# EAGLE schematic Schematic (EAGLE 9.7.0)
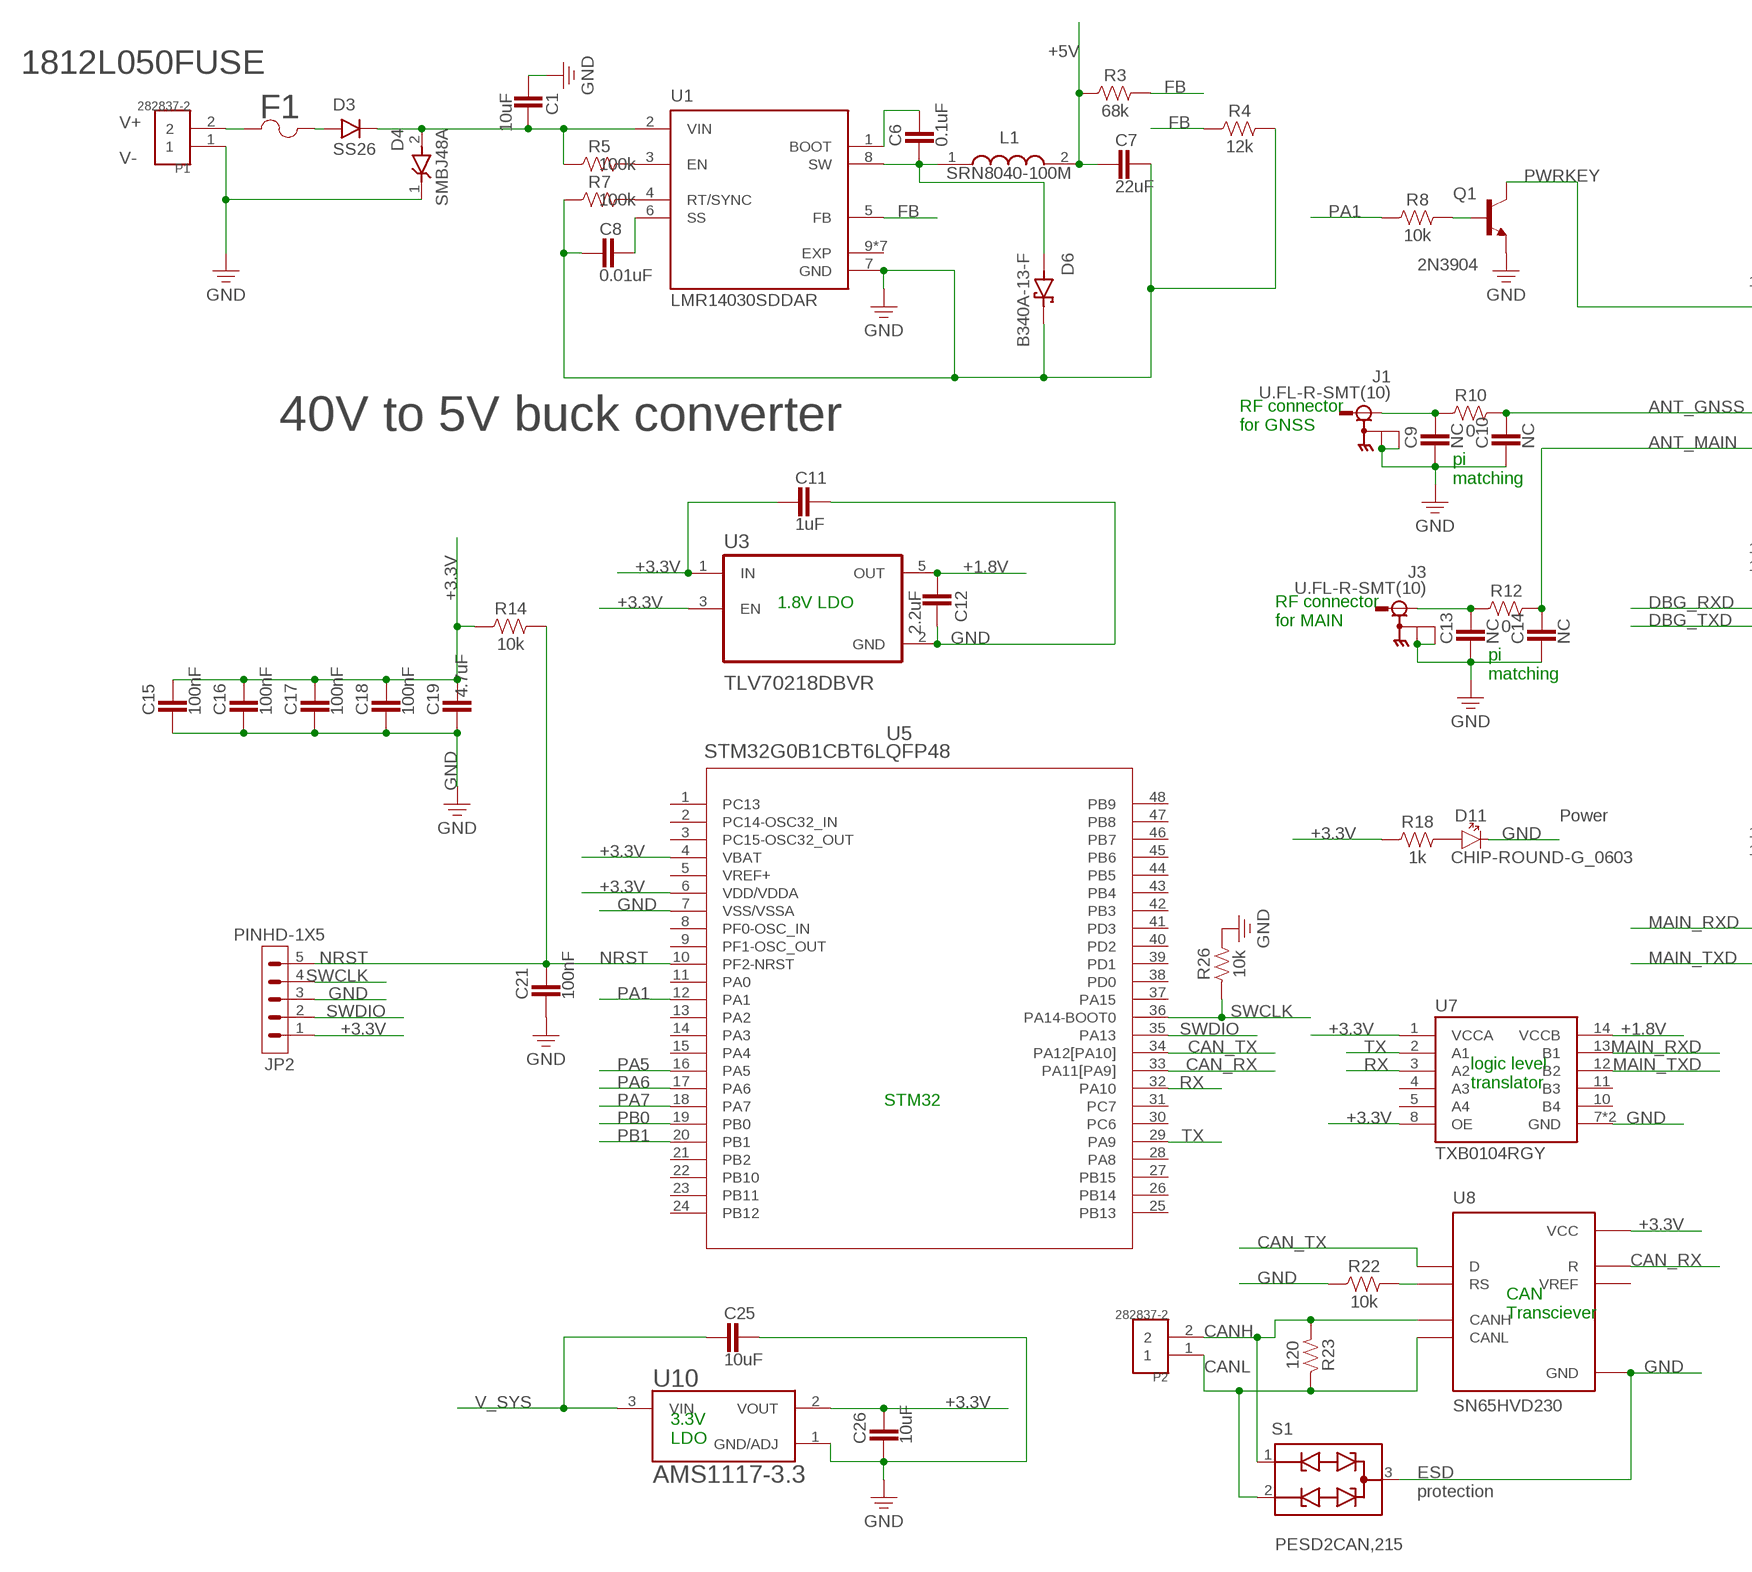
[diagram p0: schematic, sheet 1, part 1 of 2]
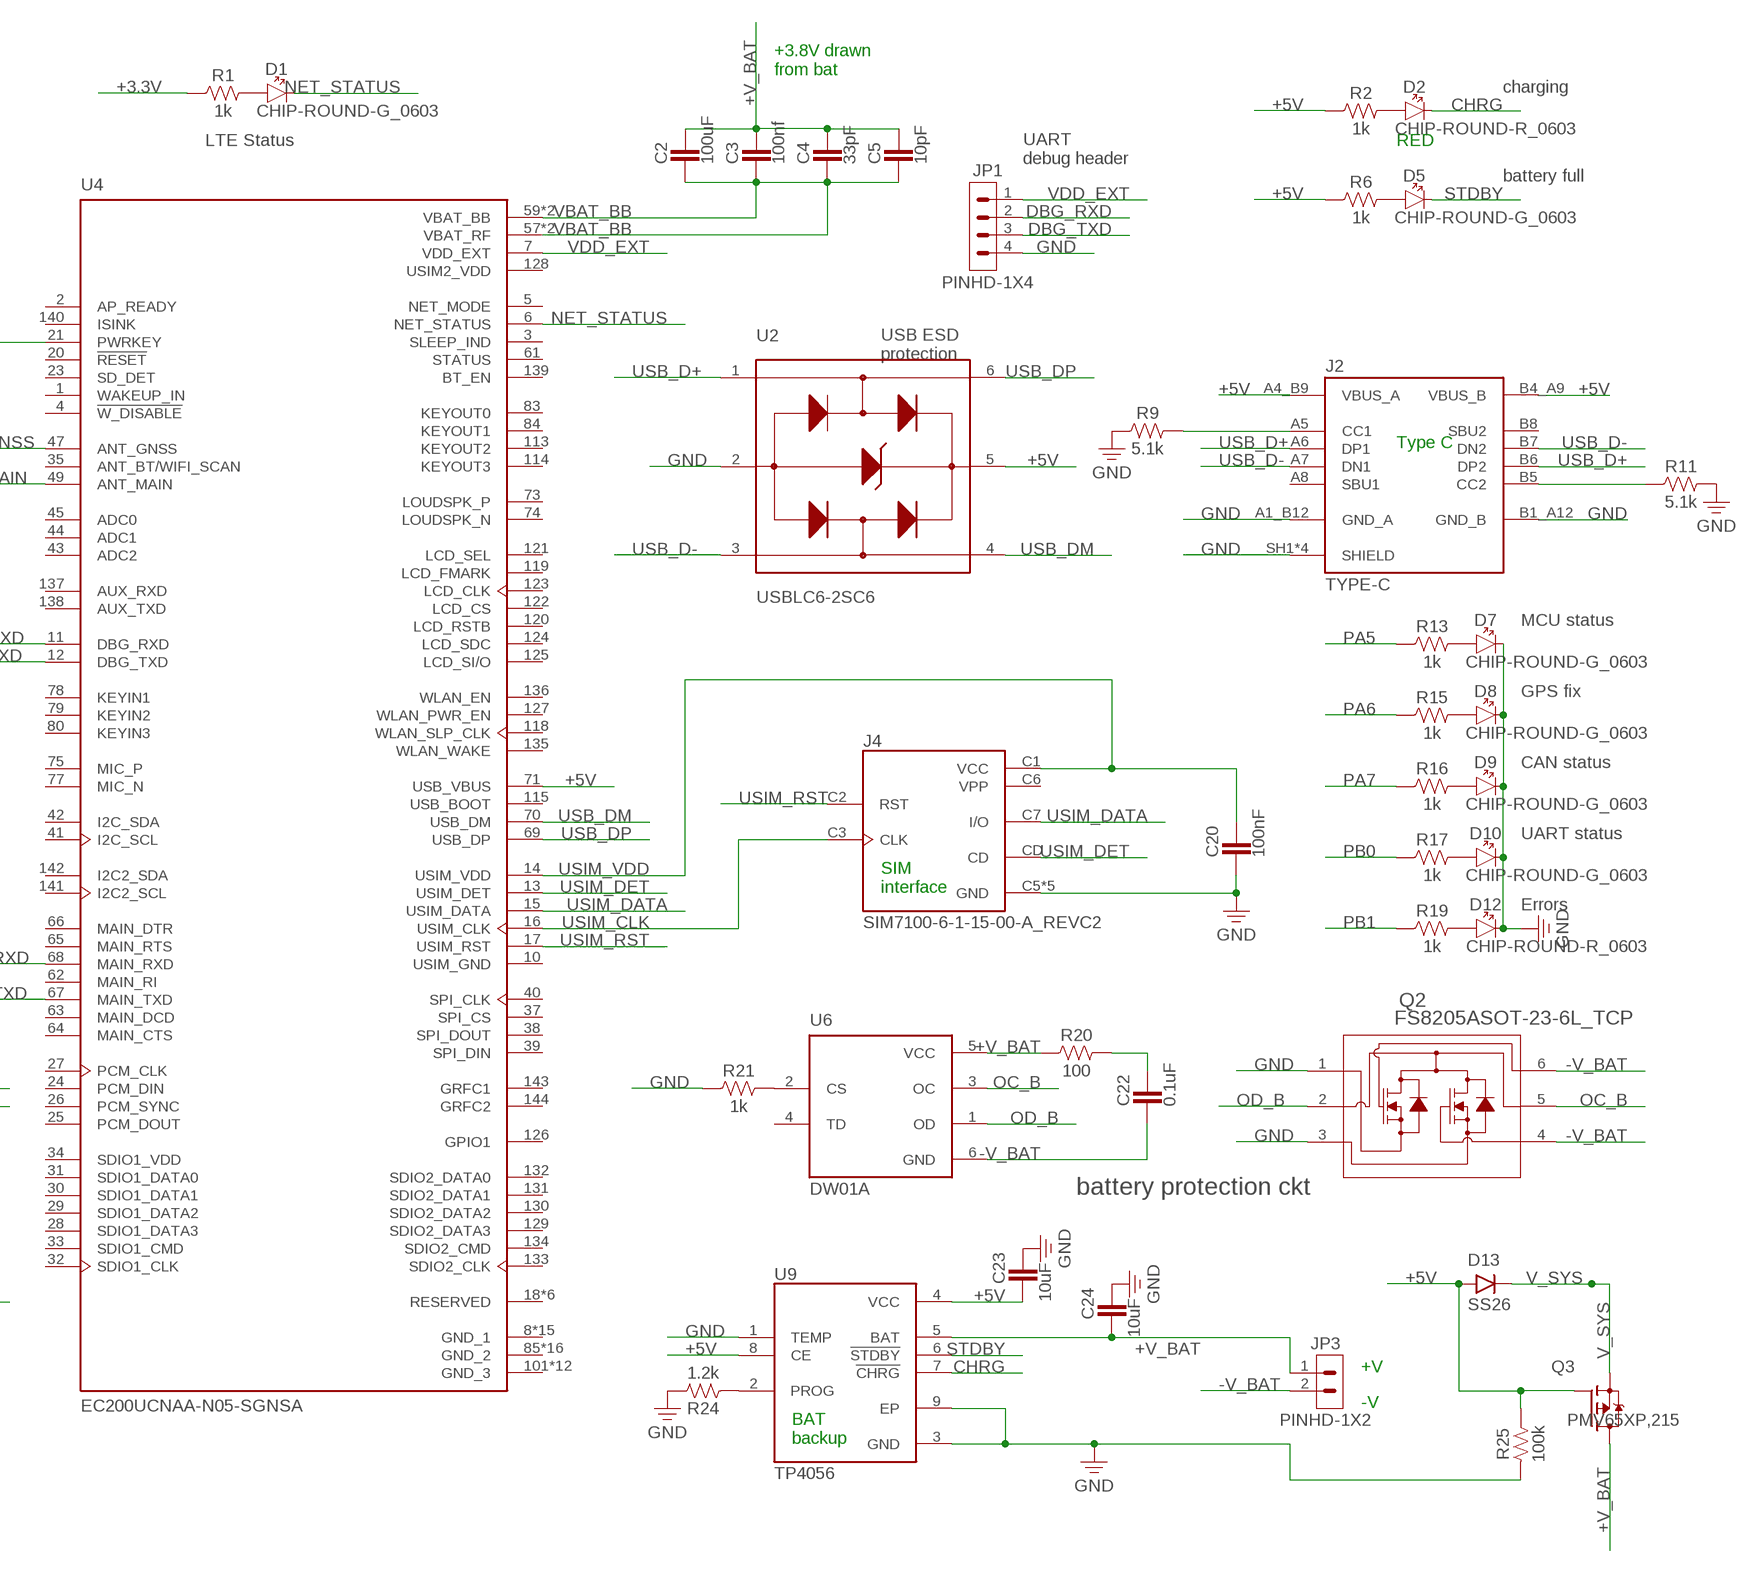
[diagram p1: schematic, sheet 1, part 2 of 2]

## Parts
C1  10uF  CAPACITOR_CHIP-0402(1005-METRIC)  [CAPC1005X60]
C2  100uF  CAPACITOR_CHIP-0603(1608-METRIC)  [CAPC1608X85]
C3  100nf  CAPACITOR_CHIP-0603(1608-METRIC)  [CAPC1608X85]
C4  33pF  CAPACITOR_CHIP-0603(1608-METRIC)  [CAPC1608X85]
C5  10pF  CAPACITOR_CHIP-0603(1608-METRIC)  [CAPC1608X85]
C6  0.1uF  CAPACITOR_CHIP-0402(1005-METRIC)  [CAPC1005X60]
C7  22uF  CAPACITOR_CHIP-0402(1005-METRIC)  [CAPC1005X60]
C8  0.01uF  CAPACITOR_CHIP-0402(1005-METRIC)  [CAPC1005X60]
C9  NC  CAPACITOR_CHIP-0402(1005-METRIC)  [CAPC1005X60]
C10  NC  CAPACITOR_CHIP-0402(1005-METRIC)  [CAPC1005X60]
C11  1uF  CAPACITOR_CHIP-0402(1005-METRIC)  [CAPC1005X60]
C12  2.2uF  CAPACITOR_CHIP-0402(1005-METRIC)  [CAPC1005X60]
C13  NC  CAPACITOR_CHIP-0402(1005-METRIC)  [CAPC1005X60]
C14  NC  CAPACITOR_CHIP-0402(1005-METRIC)  [CAPC1005X60]
C15  100nF  CAPACITOR_CHIP-0402(1005-METRIC)  [CAPC1005X60]
C16  100nF  CAPACITOR_CHIP-0402(1005-METRIC)  [CAPC1005X60]
C17  100nF  CAPACITOR_CHIP-0402(1005-METRIC)  [CAPC1005X60]
C18  100nF  CAPACITOR_CHIP-0402(1005-METRIC)  [CAPC1005X60]
C19  4.7uF  CAPACITOR_CHIP-0402(1005-METRIC)  [CAPC1005X60]
C20  100nF  CAPACITOR_CHIP-0402(1005-METRIC)  [CAPC1005X60]
C21  100nF  CAPACITOR_CHIP-0402(1005-METRIC)  [CAPC1005X60]
C22  0.1uF  CAPACITOR_CHIP-0402(1005-METRIC)  [CAPC1005X60]
C23  10uF  CAPACITOR_CHIP-0402(1005-METRIC)  [CAPC1005X60]
C24  10uF  CAPACITOR_CHIP-0402(1005-METRIC)  [CAPC1005X60]
C25  10uF  CAPACITOR_CHIP-0402(1005-METRIC)  [CAPC1005X60]
C26  10uF  CAPACITOR_CHIP-0402(1005-METRIC)  [CAPC1005X60]
D1  CHIP-ROUND-G_0603  [LEDC1608X65N_RND-G]
D2  CHIP-ROUND-R_0603  [LEDC1608X65N_RND-R]
D3  SS26  [SS26]
D4  SMBJ48A  [DIOM5436X261N]
D5  CHIP-ROUND-G_0603  [LEDC1608X65N_RND-G]
D6  B340A-13-F  [DIOM5226X240N]
D7  CHIP-ROUND-G_0603  [LEDC1608X65N_RND-G]
D8  CHIP-ROUND-G_0603  [LEDC1608X65N_RND-G]
D9  CHIP-ROUND-G_0603  [LEDC1608X65N_RND-G]
D10  CHIP-ROUND-G_0603  [LEDC1608X65N_RND-G]
D11  CHIP-ROUND-G_0603  [LEDC1608X65N_RND-G]
D12  CHIP-ROUND-R_0603  [LEDC1608X65N_RND-R]
D13  SS26  [SS26]
F1  1812L050FUSE  1812L050/60MRFUSE_1812L05060_LTF  [FUSE_1812L05060_LTF]
J1  U.FL-R-SMT(10)  [HIROSE_U.FL-R-SMT(10)]
J2  TYPE-C  TYPE-C_16PIN_2MD_(073)  [SHOUHAN_TYPE-C_16PIN_2MD_(073)]
J3  U.FL-R-SMT(10)  [HIROSE_U.FL-R-SMT(10)]
J4  SIM7100-6-1-15-00-A_REVC2  [GCT_SIM7100-6-1-15-00-A_REVC2]
JP1  PINHD-1X4  [1X04]
JP2  PINHD-1X5  [1X05]
JP3  PINHD-1X2  [1X02]
L1  SRN8040-100M  [SRN8040100M]
P1  282837-2  [TE_282837-2]
P2  282837-2  [TE_282837-2]
Q1  2N3904  [TO92127P495H495-3]
Q2  FS8205ASOT-23-6L_TCP  [SOT-23-6L_TCP]
Q3  PMV65XP,215  [SOT95P230X110-3N]
R1  1k  R-US_CHIP-0402(1005-METRIC)  [RESC1005X40]
R2  1k  R-US_CHIP-0402(1005-METRIC)  [RESC1005X40]
R3  68k  R-US_CHIP-0402(1005-METRIC)  [RESC1005X40]
R4  12k  R-US_CHIP-0402(1005-METRIC)  [RESC1005X40]
R5  100k  R-US_CHIP-0402(1005-METRIC)  [RESC1005X40]
R6  1k  R-US_CHIP-0402(1005-METRIC)  [RESC1005X40]
R7  100k  R-US_CHIP-0402(1005-METRIC)  [RESC1005X40]
R8  10k  R-US_CHIP-0402(1005-METRIC)  [RESC1005X40]
R9  5.1k  R-US_CHIP-0402(1005-METRIC)  [RESC1005X40]
R10  0  R-US_CHIP-0402(1005-METRIC)  [RESC1005X40]
R11  5.1k  R-US_CHIP-0402(1005-METRIC)  [RESC1005X40]
R12  0  R-US_CHIP-0402(1005-METRIC)  [RESC1005X40]
R13  1k  R-US_CHIP-0402(1005-METRIC)  [RESC1005X40]
R14  10k  R-US_CHIP-0402(1005-METRIC)  [RESC1005X40]
R15  1k  R-US_CHIP-0402(1005-METRIC)  [RESC1005X40]
R16  1k  R-US_CHIP-0402(1005-METRIC)  [RESC1005X40]
R17  1k  R-US_CHIP-0402(1005-METRIC)  [RESC1005X40]
R18  1k  R-US_CHIP-0402(1005-METRIC)  [RESC1005X40]
R19  1k  R-US_CHIP-0402(1005-METRIC)  [RESC1005X40]
R20  100  R-US_CHIP-0402(1005-METRIC)  [RESC1005X40]
R21  1k  R-US_CHIP-0402(1005-METRIC)  [RESC1005X40]
R22  10k  R-US_CHIP-0402(1005-METRIC)  [RESC1005X40]
R23  120  R-US_CHIP-0402(1005-METRIC)  [RESC1005X40]
R24  1.2k  R-US_CHIP-0402(1005-METRIC)  [RESC1005X40]
R25  100k  R-US_CHIP-0402(1005-METRIC)  [RESC1005X40]
R26  10k  R-US_CHIP-0402(1005-METRIC)  [RESC1005X40]
S1  PESD2CAN,215  [DIO_PESD2CAN,215]
U1  LMR14030SDDAR  [SOIC127P600X170-9N]
U2  USBLC6-2SC6  [SOT95P280X145-6N]
U3  TLV70218DBVR  [SOT95P280X145-5N]
U4  EC200UCNAA-N05-SGNSA  [XCVR_EC200UCNAA-N05-SGNSA]
U5  STM32G0B1CBT6LQFP48  STM32G0B1CBT6LQFP48_STM32G0B1CBT_STM  [LQFP48_STM32G0B1CBT_STM]
U6  DW01A  [SOT95P280X145-6N]
U7  TXB0104RGY  [S-PVQFN-N14]
U8  SN65HVD230  [SOIC127P599X175-8N]
U9  TP4056  [SOP127P600X175-9N]
U10  AMS1117-3.3  [SOT229P700X180-4N]

## Nets
+1.8V: C12.2 U3.5(OUT) U7.14(VCCB)
+3.3V: C11.2 C15.1 C16.1 C17.1 C18.1 C19.1 C26.1 JP2.1 R1.1 R14.1 R18.1 U3.1(IN) U3.3(EN) U5.4(VBAT) U5.6(VDD/VDDA) U7.1(VCCA) U7.8(OE) U8.3(VCC) U10.2(VOUT)
+5V: C7.2 C23.2 D13.A J2.A4_B9(VBUS_A) J2.B4_A9(VBUS_B) L1.2 Q3.1(G) R2.1 R3.1 R6.1 R25.2 U2.5(VBUS) U4.71(USB_VBUS) U9.4(VCC) U9.8(CE)
+V_BAT: C2.1 C3.1 C4.1 C5.1 C24.2 JP3.1 Q3.3(D) R20.1 U6.5(VCC) U9.5(BAT)
-V_BAT: C22.2 JP3.2 Q2.4 Q2.6 U6.6(GND)
ANT_GNSS: C10.1 R10.2 U4.47(ANT_GNSS)
ANT_MAIN: C14.1 R12.2 U4.49(ANT_MAIN)
CAN_RX: U5.33(PA11[PA9]) U8.4(R)
CAN_TX: U5.34(PA12[PA10]) U8.1(D)
CANH: P2.2 R23.2 S1.1(C1) U8.7(CANH)
CHRG: D2.C U9.7(!CHRG)
DBG_RXD: JP1.2 U4.11(DBG_RXD)
DBG_TXD: JP1.3 U4.12(DBG_TXD)
FB: R3.2 R4.1 U1.5(FB)
GND: C1.2 C7.1 C8.2 C9.2 C10.2 C11.1 C12.1 C13.2 C14.2 C15.2 C16.2 C17.2 C18.2 C19.2 C20.2 C21.2 C23.1 C24.1 C25.1 C26.2 D4.1(K) D6.C D7.C D8.C D9.C D10.C D11.C D12.C J1.G1 J1.G2 J2.A1_B12(GND_A) J2.B1_A12(GND_B) J2.SH1(SHIELD) J2.SH2(SHIELD) J2.SH3(SHIELD) J2.SH4(SHIELD) J3.G1 J3.G2 J4.C5(GND) J4.G1(GND) J4.G2(GND) J4.G3(GND) J4.G4(GND) JP1.4 JP2.3 P1.1 Q1.1(E) Q2.1 Q2.3 R4.2 R7.1 R9.1 R11.2 R21.1 R22.1 R24.2 R25.1 R26.2 S1.3(CC) U1.7(GND) U2.2(GND) U3.2(GND) U5.7(VSS/VSSA) U7.7(GND) U7.THERMALPAD(GND) U8.2(GND) U9.1(TEMP) U9.3(GND) U9.9(EP) U10.1(GND/ADJ)
MAIN_RXD: U4.68(MAIN_RXD) U7.13(B1)
MAIN_TXD: U4.67(MAIN_TXD) U7.12(B2)
N$1: Q1.2(B) R8.2
N$2: J2.A5(CC1) R9.2
N$3: J2.B5(CC2) R11.1
N$4: C9.1 J1.SIG R10.1
N$5: R24.1 U9.2(PROG)
N$6: D2.A R2.2
N$7: D5.A R6.2
N$8: C13.1 J3.SIG R12.1
N$9: R22.2 U8.8(RS)
N$10: F1.1 P1.2
N$11: D3.A F1.2
N$12: C1.1 D3.C D4.2(A) R5.1 U1.2(VIN)
N$13: C6.1 U1.1(BOOT)
N$14: C6.2 D6.A L1.1 U1.8(SW)
N$15: R5.2 U1.3(EN)
N$16: R7.2 U1.4(RT/SYNC)
N$17: C8.1 U1.6(SS)
N$18: R21.2 U6.2(CS)
N$19: D11.A R18.2
N$20: C22.1 R20.2
N$21: P2.1 R23.1 S1.2(C2) U8.6(CANL)
N$22: D1.A R1.2
N$23: D7.A R13.2
N$24: D8.A R15.2
N$25: D9.A R16.2
N$26: D10.A R17.2
N$27: D12.A R19.2
NET_STATUS: D1.C U4.6(NET_STATUS)
NRST: C21.1 JP2.5 R14.2 U5.10(PF2-NRST)
OC_B: Q2.5 U6.3(OC)
OD_B: Q2.2 U6.1(OD)
PA1: R8.1 U5.12(PA1)
PA5: R13.1 U5.16(PA5)
PA6: R15.1 U5.17(PA6)
PA7: R16.1 U5.18(PA7)
PB0: R17.1 U5.19(PB0)
PB1: R19.1 U5.20(PB1)
PWRKEY: Q1.3(C) U4.21(PWRKEY)
RX: U5.32(PA10) U7.3(A2)
STDBY: D5.C U9.6(!STDBY)
SWCLK: JP2.4 R26.1 U5.36(PA14-BOOT0)
SWDIO: JP2.2 U5.35(PA13)
TX: U5.29(PA9) U7.2(A1)
USB_D+: J2.A6(DP1) J2.B6(DP2) U2.1(I/O1_IN)
USB_D-: J2.A7(DN1) J2.B7(DN2) U2.3(I/O2_IN)
USB_DM: U2.4(I/O2_OUT) U4.70(USB_DM)
USB_DP: U2.6(I/O1_OUT) U4.69(USB_DP)
USIM_CLK: J4.C3(CLK) U4.16(USIM_CLK)
USIM_DATA: J4.C7(I/O) U4.15(USIM_DATA)
USIM_DET: J4.CD U4.13(USIM_DET)
USIM_RST: J4.C2(RST) U4.17(USIM_RST)
USIM_VDD: C20.1 J4.C1(VCC) U4.14(USIM_VDD)
V_SYS: C25.2 D13.C Q3.2(S) U10.3(VIN)
VBAT_BB: C2.2 C3.2 C4.2 C5.2 U4.57(VBAT_RF) U4.58(VBAT_RF) U4.59(VBAT_BB) U4.60(VBAT_BB)
VDD_EXT: JP1.1 U4.7(VDD_EXT)
Unconnected: J2.A8(SBU1) J2.B8(SBU2) U4.1(WAKEUP_IN) U4.2(AP_READY) U4.3(SLEEP_IND) U4.4(!W_DISABLE) U4.5(NET_MODE) U4.18(RESERVED) U4.20(!RESET) U4.23(SD_DET) U4.24(PCM_DIN) U4.25(PCM_DOUT) U4.26(PCM_SYNC) U4.27(PCM_CLK) U4.28(SDIO1_DATA3) U4.29(SDIO1_DATA2) U4.30(SDIO1_DATA1) U4.31(SDIO1_DATA0) U4.32(SDIO1_CLK) U4.33(SDIO1_CMD) U4.35(ANT_BT/WIFI_SCAN) U4.37(SPI_CS) U4.38(SPI_DOUT) U4.39(SPI_DIN) U4.40(SPI_CLK) U4.41(I2C_SCL) U4.42(I2C_SDA) U4.43(ADC2) U4.44(ADC1) U4.45(ADC0) U4.55(RESERVED) U4.61(STATUS) U4.62(MAIN_RI) U4.63(MAIN_DCD) U4.64(MAIN_CTS) U4.65(MAIN_RTS) U4.66(MAIN_DTR) U4.73(LOUDSPK_P) U4.74(LOUDSPK_N) U4.75(MIC_P) U4.77(MIC_N) U4.78(KEYIN1) U4.79(KEYIN2) U4.80(KEYIN3) U4.81(RESERVED) U4.82(RESERVED) U4.83(KEYOUT0) U4.84(KEYOUT1) U4.113(KEYOUT2) U4.114(KEYOUT3) U4.115(USB_BOOT) U4.116(RESERVED) U4.117(RESERVED) U4.118(WLAN_SLP_CLK) U4.119(LCD_FMARK) U4.120(LCD_RSTB) U4.121(LCD_SEL) U4.122(LCD_CS) U4.123(LCD_CLK) U4.124(LCD_SDC) U4.125(LCD_SI/O) U4.126(GPIO1) U4.127(WLAN_PWR_EN) U4.129(SDIO2_DATA3) U4.130(SDIO2_DATA2) U4.131(SDIO2_DATA1) U4.132(SDIO2_DATA0) U4.133(SDIO2_CLK) U4.134(SDIO2_CMD) U4.135(WLAN_WAKE) U4.136(WLAN_EN) U4.137(AUX_RXD) U4.138(AUX_TXD) U4.139(BT_EN) U4.140(ISINK) U4.141(I2C2_SCL) U4.142(I2C2_SDA) U4.143(GRFC1) U4.144(GRFC2) U5.1(PC13) U5.2(PC14-OSC32_IN) U5.3(PC15-OSC32_OUT) U5.8(PF0-OSC_IN) U5.9(PF1-OSC_OUT) U5.11(PA0) U5.13(PA2) U5.14(PA3) U5.15(PA4) U5.21(PB2) U5.22(PB10) U5.23(PB11) U5.24(PB12) U5.25(PB13) U5.26(PB14) U5.27(PB15) U5.28(PA8) U5.30(PC6) U5.31(PC7) U5.37(PA15) U5.38(PD0) U5.39(PD1) U5.40(PD2) U5.41(PD3) U5.42(PB3) U5.43(PB4) U5.44(PB5) U5.45(PB6) U5.46(PB7) U5.47(PB8) U5.48(PB9) U6.4(TD) U7.4(A3) U7.5(A4) U7.10(B4) U7.11(B3) U8.5(VREF)

## Notes on the sheet
- +3.8V drawn
  from bat
- charging
- LTE Status | RED
- V+
- UART 
  debug header
- battery full
- V-
- USB ESD
  protection
- Type C
- 40V to 5V buck converter
- RF connector 
  for GNSS
- pi 
  matching
- MCU status
- 1.8V LDO
- RF connector 
  for MAIN
- GPS fix
- pi 
  matching
- CAN status
- UART status
- Power
- SIM
  interface
- Errors
- logic level
  translator
- STM32
- battery protection ckt
- CANH
- CAN
  Transciever
- +V
- CANL | -V
- BAT
  backup
- 3.3V
  LDO
- ESD
  protection

## Power pins joined to a net without a drawn wire
EXP: U1.9(EXP) U1.V1(EXP) U1.V2(EXP) U1.V3(EXP) U1.V4(EXP) U1.V5(EXP) U1.V6(EXP)
GND_1: U4.8(GND_1) U4.9(GND_1) U4.19(GND_1) U4.22(GND_1) U4.36(GND_1) U4.46(GND_1) U4.48(GND_1) U4.50(GND_1) U4.51(GND_1) U4.52(GND_1) U4.53(GND_1) U4.54(GND_1) U4.56(GND_1) U4.72(GND_1) U4.76(GND_1)
GND_2: U4.85(GND_2) U4.86(GND_2) U4.87(GND_2) U4.88(GND_2) U4.89(GND_2) U4.90(GND_2) U4.91(GND_2) U4.92(GND_2) U4.93(GND_2) U4.94(GND_2) U4.95(GND_2) U4.96(GND_2) U4.97(GND_2) U4.98(GND_2) U4.99(GND_2) U4.100(GND_2)
GND_3: U4.101(GND_3) U4.102(GND_3) U4.103(GND_3) U4.104(GND_3) U4.105(GND_3) U4.106(GND_3) U4.107(GND_3) U4.108(GND_3) U4.109(GND_3) U4.110(GND_3) U4.111(GND_3) U4.112(GND_3)
SDIO1_VDD: U4.34(SDIO1_VDD)
USIM2_VDD: U4.128(USIM2_VDD)
USIM_GND: U4.10(USIM_GND)
VPP: J4.C6(VPP)
VREF+: U5.5(VREF+)

## Library data of the parts
C1-C26 = Tinkercad:CAPACITOR: Capacitor - Generic; CATEGORY: Capacitor
D1 D5 D7-D11 = LED:CHIP-ROUND-G: Green LED - Generic; CATEGORY: LED; COLOR: Green; DESCRIPTION: Green LED Indication 0603 (1608 Metric); PACKAGE_SIZE: 0603; PACKAGE_TYPE: Surface Mount; SUBCATEGORY: Chip LED; TYPE: Square with Domed Top
D2 D12 = LED:CHIP-ROUND-R: Red LED - Generic; CATEGORY: LED; COLOR: Red; DESCRIPTION: Red LED Indication 0603 (1608 Metric); PACKAGE_SIZE: 0603; PACKAGE_TYPE: Surface Mount; SUBCATEGORY: Chip LED; TYPE: Square with Domed Top
D3 D13 = SS26:SS26: Check availability <https://pricing.snapeda.com/parts/SS26/ON%20Semiconductor/view-part?ref=eda>; AVAILABILITY: In Stock; CHECK_PRICES: https://www.snapeda.com/parts/SS26/Onsemi/view-part/?ref=eda; DESCRIPTION: Schottkydiod 2 A 60 V DO-214AA%3DSMB | Vishay SS26 @ Schottkydioder (Schottkydiod 2 A 60 V DO-214AA%3DSMB Dioder / Småsignals Schottky-dioder); MF: ON Semiconductor; MP: SS26; PACKAGE: SMB-2 ON Semiconductor; PRICE: None; SNAPEDA_LINK: https://www.snapeda.com/parts/SS26/Onsemi/view-part/?ref=snap
D4 = SMBJ48A:SMBJ48A: Check availability <https://pricing.snapeda.com/parts/SMBJ48A/Littelfuse/view-part?ref=eda>; AVAILABILITY: In Stock; CHECK_PRICES: https://www.snapeda.com/parts/SMBJ48A/Littelfuse/view-part/?ref=eda; DESCRIPTION: TVS Diode, 600W, 48V, -65 to 150 Operating Temp, Surface Mount, SMBJ Series | Littelfuse SMBJ48A; MF: Littelfuse; MP: SMBJ48A; PACKAGE: DO-214 Littelfuse; PRICE: None; SNAPEDA_LINK: https://www.snapeda.com/parts/SMBJ48A/Littelfuse/view-part/?ref=snap
D6 = B340A-13-F:B340A-13-F: Check availability <https://pricing.snapeda.com/parts/B340A-13-F/Diodes%20Inc./view-part?ref=eda>; AVAILABILITY: In Stock; CHECK_PRICES: https://www.snapeda.com/parts/B340A-13-F/Diodes+Inc./view-part/?ref=eda; DESCRIPTION: Schottky Diode 3A 40V 0.5Vf SMA | Diodes Inc B340A-13-F; MF: Diodes Inc.; MP: B340A-13-F; PACKAGE: DO-214 Diodes Inc.; PRICE: None; SNAPEDA_LINK: https://www.snapeda.com/parts/B340A-13-F/Diodes+Inc./view-part/?ref=snap
F1 = 1812L05060MR:1812L050/60MR; COPYRIGHT: Copyright (C) 2026 Ultra Librarian. All rights reserved.; MANUFACTURER_NAME: Littelfuse Inc; MANUFACTURER_PART_NUMBER: 1812L050/60MR
J1 J3 = U.FL-R-SMT_10_:U.FL-R-SMT(10): Check availability <https://pricing.snapeda.com/parts/U.FL-R-SMT%2810%29/Hirose%20Electric%20Co%20Ltd/view-part?ref=eda>; AVAILABILITY: In Stock; CHECK_PRICES: https://www.snapeda.com/parts/U.FL-R-SMT(10)/Hirose+Electric+Co+Ltd/view-part/?ref=eda; DESCRIPTION: U.FL (UMCC) Connector Receptacle, Male Pin 50 Ohms Surface Mount Solder; MF: Hirose Electric Co Ltd; MP: U.FL-R-SMT(10); PACKAGE: None; PRICE: None; SNAPEDA_LINK: https://www.snapeda.com/parts/U.FL-R-SMT(10)/Hirose+Electric+Co+Ltd/view-part/?ref=snap
J2 = TYPE-C_16PIN_2MD__073_:TYPE-C_16PIN_2MD_(073): Check availability <https://pricing.snapeda.com/parts/TYPE-C%2016PIN%202MD%20%28073%29/Shouhan/view-part?ref=eda>; AVAILABILITY: Not in stock; CHECK_PRICES: https://www.snapeda.com/parts/TYPE-C%2016PIN%202MD%20(073)/Shouhan/view-part/?ref=eda; DESCRIPTION: DC-5V 5A Type C USB; MF: Shouhan; MP: TYPE-C 16PIN 2MD (073); PACKAGE: Package; PRICE: None; SNAPEDA_LINK: https://www.snapeda.com/parts/TYPE-C%2016PIN%202MD%20(073)/Shouhan/view-part/?ref=snap
J4 = SIM7100-6-1-15-00-A_REVC2:SIM7100-6-1-15-00-A_REVC2: Check availability <https://pricing.snapeda.com/parts/SIM7100-6-1-15-00-A/Global%20Connector%20Technology/view-part?ref=eda>; AVAILABILITY: In Stock; CHECK_PRICES: https://www.snapeda.com/parts/SIM7100-6-1-15-00-A/Global+Connector+Technology/view-part/?ref=eda; DESCRIPTION: 7 (6 + 1) Position Card Connector Micro SIM Surface Mount, Right Angle Gold; MF: Global Connector Technology; MP: SIM7100-6-1-15-00-A; PACKAGE: None; PRICE: None; SNAPEDA_LINK: https://www.snapeda.com/parts/SIM7100-6-1-15-00-A/Global+Connector+Technology/view-part/?ref=snap
JP1 = Connector:PINHD-1X4: Pin Header; CATEGORY: Connectors; DESCRIPTION: Header-Straight-4 Position; PACKAGE_TYPE: Through Hole; PITCH: 0.100" (2.54mm); SUBCATEGORY: Headers; TYPE: Male Pins
JP2 = Connector:PINHD-1X5: Pin Header; CATEGORY: Connectors; DESCRIPTION: Header-Straight-5 Position; PACKAGE_TYPE: Through Hole; PITCH: 0.100" (2.54mm); SUBCATEGORY: Headers; TYPE: Male Pins
JP3 = Connector:PINHD-1X2: Pin Header; CATEGORY: Connectors; DESCRIPTION: Header-Straight-2 Position; PACKAGE_TYPE: Through Hole; PITCH: 0.100" (2.54mm); SUBCATEGORY: Headers; TYPE: Male Pins
L1 = SRN8040-100M:SRN8040-100M: Bourns SRN8040 Series Type SMD Shielded Wire-wound SMD Inductor with a Ferrite Core, 10 uH +/-20% Semi-Shielded 3.1A Idc Source: Datasheet <https://componentsearchengine.com/Datasheets/1/SRN8040-100M.pdf>; ARROW_PART_NUMBER: SRN8040-100M; ARROW_PRICE-STOCK: https://www.arrow.com/en/products/srn8040-100m/bourns?region=nac; DESCRIPTION: Bourns SRN8040 Series Type SMD Shielded Wire-wound SMD Inductor with a Ferrite Core, 10 uH +/-20% Semi-Shielded 3.1A Idc; HEIGHT: 4mm; MANUFACTURER_NAME: Bourns; MANUFACTURER_PART_NUMBER: SRN8040-100M; MOUSER_PART_NUMBER: 652-SRN8040-100M; MOUSER_PRICE-STOCK: https://www.mouser.co.uk/ProductDetail/Bourns/SRN8040-100M?qs=opBjA1TV901MvrktVUEKyA%3D%3D
P1 P2 = 282837-2:282837-2: Check availability <https://pricing.snapeda.com/parts/282837-2/TE%20Connectivity/view-part?ref=eda>; AVAILABILITY: In Stock; CHECK_PRICES: https://www.snapeda.com/parts/282837-2/TE+Connectivity+AMP+Connectors/view-part/?ref=eda; COMMENT: 282837-2; DESCRIPTION: Terminal Block Connector Wire Receptacle 2 5.08 mm 30-16 AWG Green 13.5 A 250 V | TE Connectivity 282837-2; MF: TE Connectivity; MP: 282837-2; PACKAGE: None; PRICE: None; SNAPEDA_LINK: https://www.snapeda.com/parts/282837-2/TE+Connectivity+AMP+Connectors/view-part/?ref=snap
Q1 = 2N3904:2N3904: Check availability <https://pricing.snapeda.com/parts/2N3904/MICROSS/On%20Semiconductor/view-part?ref=eda>; AVAILABILITY: Not in stock; CHECK_PRICES: https://www.snapeda.com/parts/2N3904/Onsemi/view-part/?ref=eda; DESCRIPTION: Trans GP BJT NPN 40V 0.2A 3-Pin SPT T/R Trans GP BJT NPN 40V 0.2A 3-Pin SPT T/R Trans GP BJT NPN 40V 0.2A 3-Pin SPT T/R; MF: MICROSS/On Semiconductor; MP: 2N3904; PACKAGE: E-PKG AXIAL-LEADED-2 ON Semiconductor; PRICE: None; SNAPEDA_LINK: https://www.snapeda.com/parts/2N3904/Onsemi/view-part/?ref=snap
Q2 = FS8205A:FS8205A; COPYRIGHT: Copyright (C) 2026 Ultra Librarian. All rights reserved.; MANUFACTURER_NAME: Tech Public; MANUFACTURER_PART_NUMBER: FS8205A
Q3 = PMV65XP_215:PMV65XP,215: Check availability <https://pricing.snapeda.com/parts/PMV65XP%2C215/Nexperia/view-part?ref=eda>; AVAILABILITY: In Stock; CHECK_PRICES: https://www.snapeda.com/parts/PMV65XP,215/Nexperia/view-part/?ref=eda; DESCRIPTION: P-Channel 20 V 2.8A (Ta) 480mW (Ta) Surface Mount TO-236AB; MF: Nexperia; MP: PMV65XP,215; PACKAGE: SOT23-3 Nexperia USA Inc.; PRICE: None; SNAPEDA_LINK: https://www.snapeda.com/parts/PMV65XP,215/Nexperia/view-part/?ref=snap
R1-R26 = Resistor:R-US: Resistor Fixed - ANSI; CATEGORY: Resistors; DESCRIPTION: Chip Resistor 1.05 X 0.54 X 0.40 mm body 0402(1005-METRIC) Package; PACKAGE_SIZE: 0402; PACKAGE_TYPE: Surface Mount
S1 = PESD2CAN_215:PESD2CAN,215: Check availability <https://pricing.snapeda.com/parts/PESD2CAN%2C215/Nexperia%20USA/view-part?ref=eda>; AVAILABILITY: In Stock; CHECK_PRICES: https://www.snapeda.com/parts/PESD2CAN,215/Nexperia/view-part/?ref=eda; DESCRIPTION: 41V Clamp 5A (8/20µs) Ipp Tvs Diode Surface Mount TO-236AB; MF: Nexperia USA; MP: PESD2CAN,215; PACKAGE: SOT23-3 Nexperia USA Inc.; PRICE: None; SNAPEDA_LINK: https://www.snapeda.com/parts/PESD2CAN,215/Nexperia/view-part/?ref=snap
U1 = LMR14030SDDAR (1):LMR14030SDDAR: Check availability <https://pricing.snapeda.com/parts/LMR14030SDDAR/Texas%20Instruments/view-part?ref=eda>; AVAILABILITY: In Stock; CHECK_PRICES: https://www.snapeda.com/parts/LMR14030SDDAR/Texas+Instruments/view-part/?ref=eda; DESCRIPTION: SIMPLE SWITCHER® 40-V, 3.5-A, 2.2-MHz step-down converter with 40-uA IQ; MF: Texas Instruments; MP: LMR14030SDDAR; PACKAGE: HSOIC-8 Texas Instruments; PRICE: None; SNAPEDA_LINK: https://www.snapeda.com/parts/LMR14030SDDAR/Texas+Instruments/view-part/?ref=snap
U2 = USBLC6-2SC6:USBLC6-2SC6: Check availability <https://pricing.snapeda.com/parts/USBLC6-2SC6/STMicroelectronics/view-part?ref=eda>; AVAILABILITY: In Stock; CHECK_PRICES: https://www.snapeda.com/parts/USBLC6-2SC6/STMicroelectronics/view-part/?ref=eda; DESCRIPTION: 17V Clamp 5A (8/20µs) Ipp Tvs Diode Surface Mount SOT-23-6; MF: STMicroelectronics; MP: USBLC6-2SC6; PACKAGE: SOT-23-6 STMicroelectronics; PRICE: None; SNAPEDA_LINK: https://www.snapeda.com/parts/USBLC6-2SC6/STMicroelectronics/view-part/?ref=snap
U3 = TLV70218DBVR:TLV70218DBVR: Check availability <https://pricing.snapeda.com/parts/TLV70218DBVR/Texas%20Instruments/view-part?ref=eda>; AVAILABILITY: In Stock; CHECK_PRICES: https://www.snapeda.com/parts/TLV70218DBVR/Texas+Instruments/view-part/?ref=eda; DESCRIPTION: 300-mA, high-PSRR, low-IQ, low-dropout voltage regulator with enable; MF: Texas Instruments; MP: TLV70218DBVR; PACKAGE: SOT-23-5 Texas Instruments; PRICE: None; SNAPEDA_LINK: https://www.snapeda.com/parts/TLV70218DBVR/Texas+Instruments/view-part/?ref=snap
U4 = EC200UCNAA-N05-SGNSA:EC200UCNAA-N05-SGNSA: Check availability <https://pricing.snapeda.com/parts/EC200UCNAA-N05-SGNSA/Quectel/view-part?ref=eda>; AVAILABILITY: In Stock; CHECK_PRICES: https://www.snapeda.com/parts/EC200UCNAA-N05-SGNSA/Quectel/view-part/?ref=eda; DESCRIPTION: Quectel 4G LTE Cat 1 wireless BT GNSS module; MF: Quectel; MP: EC200UCNAA-N05-SGNSA; PACKAGE: None; PRICE: None; SNAPEDA_LINK: https://www.snapeda.com/parts/EC200UCNAA-N05-SGNSA/Quectel/view-part/?ref=snap
U5 = stm32:STM32G0B1CBT6; COPYRIGHT: Copyright (C) 2026 Ultra Librarian. All rights reserved.; DATASHEET: https://www.st.com/resource/en/datasheet/stm32g0b1cc.pdf; DESCRIPTION: Mainstream Arm Cortex-M0+ 32-bit MCU, up to 128KB Flash, 144KB RAM, 6x USART, timers, ADC, DAC, comm. I/Fs, 1.7-3.6V; MANUFACTURER_NAME: STMicroelectronics; MANUFACTURER_PART_NUMBER: STM32G0B1CBT6
U6 = DW01A:DW01A: Check availability <https://pricing.snapeda.com/parts/DW01A/Fortune%20Semiconductor/view-part?ref=eda>; AVAILABILITY: Not in stock; CHECK_PRICES: https://www.snapeda.com/parts/DW01A/Fortune+Semiconductor/view-part/?ref=eda; DESCRIPTION: One Cell Lithium-ion/Polymer Battery Protection IC; MF: Fortune Semiconductor; MP: DW01A; PACKAGE: SOT-23-6 Fortune Semiconductor; PRICE: None; SNAPEDA_LINK: https://www.snapeda.com/parts/DW01A/Fortune+Semiconductor/view-part/?ref=snap
U7 = TXB0104:TXB0104: Check availability <https://pricing.snapeda.com/parts/TXB0104/Texas%20Instruments/view-part?ref=eda>; AVAILABILITY: In Stock; CHECK_PRICES: https://www.snapeda.com/parts/TXB0104/Texas+Instruments/view-part/?ref=eda; DESCRIPTION: 4-BIT BIDIRECTIONAL VOLTAGE-LEVEL TRANSLATOR WITH AUTO DIRECTION SENSING AND ±15-kV ESD PROTECTION; MF: Texas Instruments; MP: TXB0104; PACKAGE: None; PRICE: None; SNAPEDA_LINK: https://www.snapeda.com/parts/TXB0104/Texas+Instruments/view-part/?ref=snap
U8 = SN65HVD230:SN65HVD230: Check availability <https://pricing.snapeda.com/parts/SN65HVD230/Texas%20Instruments/view-part?ref=eda>; AVAILABILITY: In Stock; CHECK_PRICES: https://www.snapeda.com/parts/SN65HVD230/Texas+Instruments/view-part/?ref=eda; DESCRIPTION: 1/1 Transceiver Half CANbus 8-SOIC; MF: Texas Instruments; MP: SN65HVD230; PACKAGE: SOIC-8 Texas Instruments; PRICE: None; SNAPEDA_LINK: https://www.snapeda.com/parts/SN65HVD230/Texas+Instruments/view-part/?ref=snap
U9 = TP4056:TP4056: Check availability <https://pricing.snapeda.com/parts/TP4056/NanJing%20Top%20Power%20ASIC%20Corp./view-part?ref=eda>; AVAILABILITY: Not in stock; CHECK_PRICES: https://www.snapeda.com/parts/TP4056/NanJing+Top+Power+ASIC+Corp./view-part/?ref=eda; DESCRIPTION: Complete single cell Li-Ion battery with a constant current / constant voltage linear charger; MF: NanJing Top Power ASIC Corp.; MP: TP4056; PACKAGE: Package; PRICE: None; SNAPEDA_LINK: https://www.snapeda.com/parts/TP4056/NanJing+Top+Power+ASIC+Corp./view-part/?ref=snap
U10 = AMS1117-3.3:AMS1117-3.3: Check availability <https://pricing.snapeda.com/parts/AMS1117-3.3/Advanced%20Monolithic%20Systems/view-part?ref=eda>; AVAILABILITY: Not in stock; CHECK_PRICES: https://www.snapeda.com/parts/AMS1117-3.3/Advanced+Monolithic+Systems/view-part/?ref=eda; DESCRIPTION: Sot223/Pkg 1-Amp 3.3-Volt Low Drop Out Voltage Regulatator; MF: Advanced Monolithic Systems; MP: AMS1117-3.3; PACKAGE: SOT-223 Seeed Technology; PRICE: None; SNAPEDA_LINK: https://www.snapeda.com/parts/AMS1117-3.3/Advanced+Monolithic+Systems/view-part/?ref=snap